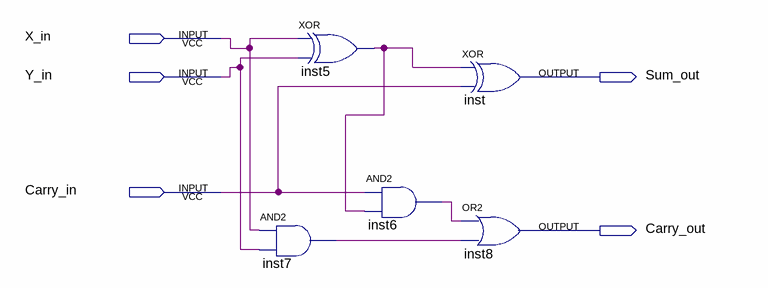
[diagram p0: schematic sheet]
// Quartus schematic fulladder1bit_p.bdf as structural Verilog: 5 symbols, 5 pins
module fulladder1bit_p (
  input  X_in,
  input  Y_in,
  input  Carry_in,
  output Sum_out,
  output Carry_out
);

  wire inst5_out, inst6_out, inst7_out;

  xor inst5 (inst5_out, X_in, Y_in);
  and inst7 (inst7_out, X_in, Y_in);
  and inst6 (inst6_out, Carry_in, inst5_out);
  xor inst (Sum_out, inst5_out, Carry_in);
  or inst8 (Carry_out, inst6_out, inst7_out);
endmodule
